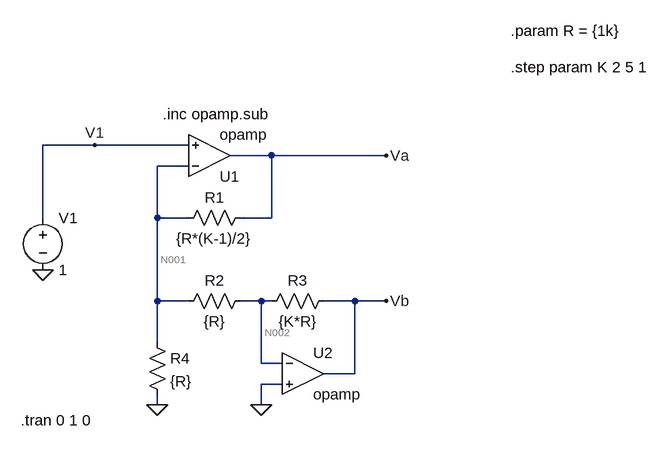
[diagram p0: schematic EJ2.asc]
EJ2.asc, the LTspice schematic file:
Version 4
SHEET 1 880 680
WIRE -64 -224 -144 -224
WIRE 80 -224 -64 -224
WIRE 208 -208 144 -208
WIRE 384 -208 208 -208
WIRE 80 -192 32 -192
WIRE -144 -112 -144 -224
WIRE 32 -112 32 -192
WIRE 80 -112 32 -112
WIRE 208 -112 208 -208
WIRE 208 -112 160 -112
WIRE 32 16 32 -112
WIRE 80 16 32 16
WIRE 192 16 160 16
WIRE 208 16 192 16
WIRE 336 16 288 16
WIRE 384 16 336 16
WIRE 32 80 32 16
WIRE 192 112 192 16
WIRE 224 112 192 112
WIRE 336 128 336 16
WIRE 336 128 288 128
WIRE 224 144 192 144
WIRE 32 176 32 160
WIRE 192 176 192 144
FLAG 32 176 0
FLAG 384 16 Vb
FLAG 192 176 0
FLAG 384 -208 Va
FLAG -64 -224 V1
FLAG -144 -32 0
SYMBOL OpAmps\\opamp 112 -144 M180
SYMATTR InstName U1
SYMBOL OpAmps\\opamp 256 64 R0
SYMATTR InstName U2
SYMBOL res 176 -128 R90
WINDOW 0 0 56 VBottom 2
WINDOW 3 32 56 VTop 2
SYMATTR InstName R1
SYMATTR Value {R*(K-1)/2}
SYMBOL res 176 0 R90
WINDOW 0 0 56 VBottom 2
WINDOW 3 32 56 VTop 2
SYMATTR InstName R2
SYMATTR Value {R}
SYMBOL res 304 0 R90
WINDOW 0 0 56 VBottom 2
WINDOW 3 32 56 VTop 2
SYMATTR InstName R3
SYMATTR Value {K*R}
SYMBOL res 16 64 R0
SYMATTR InstName R4
SYMATTR Value {R}
SYMBOL voltage -144 -128 R0
WINDOW 123 0 0 Left 0
WINDOW 39 0 0 Left 0
SYMATTR InstName V1
SYMATTR Value 1
TEXT 40 -272 Left 2 !.inc opamp.sub
TEXT 576 -400 Left 2 !.param R = {1k}
TEXT 576 -344 Left 2 !.step param K 2 5 1
TEXT -178 200 Left 2 !.tran 0 1 0

The netlist it stands for:
* EJ2.asc
XU1 N001 V1 Va opamp Aol=100K GBW=10Meg  ; pins invin noninvin out
XU2 N002 0 Vb opamp Aol=100K GBW=10Meg  ; pins invin noninvin out
R1 Va N001 {R*(K-1)/2}
R2 N002 N001 {R}
R3 Vb N002 {K*R}
R4 N001 0 {R}
V1 V1 0 1
.inc opamp.sub
.param R = {1k}
.step param K 2 5 1
.tran 0 1 0
.backanno
.end

* Results of the author's LTspice run, read from the files saved beside the schematic
* Operating Point (first step), zero values left out:
*   k = 2 
*   V(va) = 2 V
*   V(v1) = 1 V
*   V(n001) = 1 V
*   V(vb) = -2 V
*   V(n002) = 20.01 µV
*   I(R4) = 1 mA
*   I(R3) = -1 mA
*   I(R2) = -1 mA
*   I(R1) = 2 mA
*   Ix(u1:3) = -2 mA
*   Ix(u2:3) = 1 mA
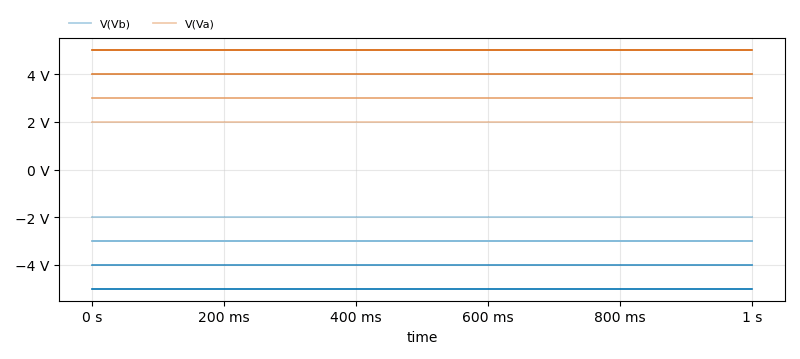
[diagram p1: Transient Analysis of EJ2.asc, plotted from the saved traces]
* Transient Analysis, 4 runs:
*   V(Vb) [k=2]: min -2 V, max -2 V, average -2 V, rms 2 V, last -2 V
*   V(Vb) [k=3]: min -3 V, max -3 V, average -3 V, rms 3 V, last -3 V
*   V(Vb) [k=4]: min -4 V, max -4 V, average -4 V, rms 4 V, last -4 V
*   V(Vb) [k=5]: min -4.999 V, max -4.999 V, average -4.999 V, rms 4.999 V, last -4.999 V
*   V(Va) [k=2]: min 2 V, max 2 V, average 2 V, rms 2 V, last 2 V
*   V(Va) [k=3]: min 3 V, max 3 V, average 3 V, rms 3 V, last 3 V
*   V(Va) [k=4]: min 4 V, max 4 V, average 4 V, rms 4 V, last 4 V
*   V(Va) [k=5]: min 5 V, max 5 V, average 5 V, rms 5 V, last 5 V